# Altium schematic sheet PCB1.schdoc
size 306 x 217 mm; SheetNumber: 1; SheetTotal: 1
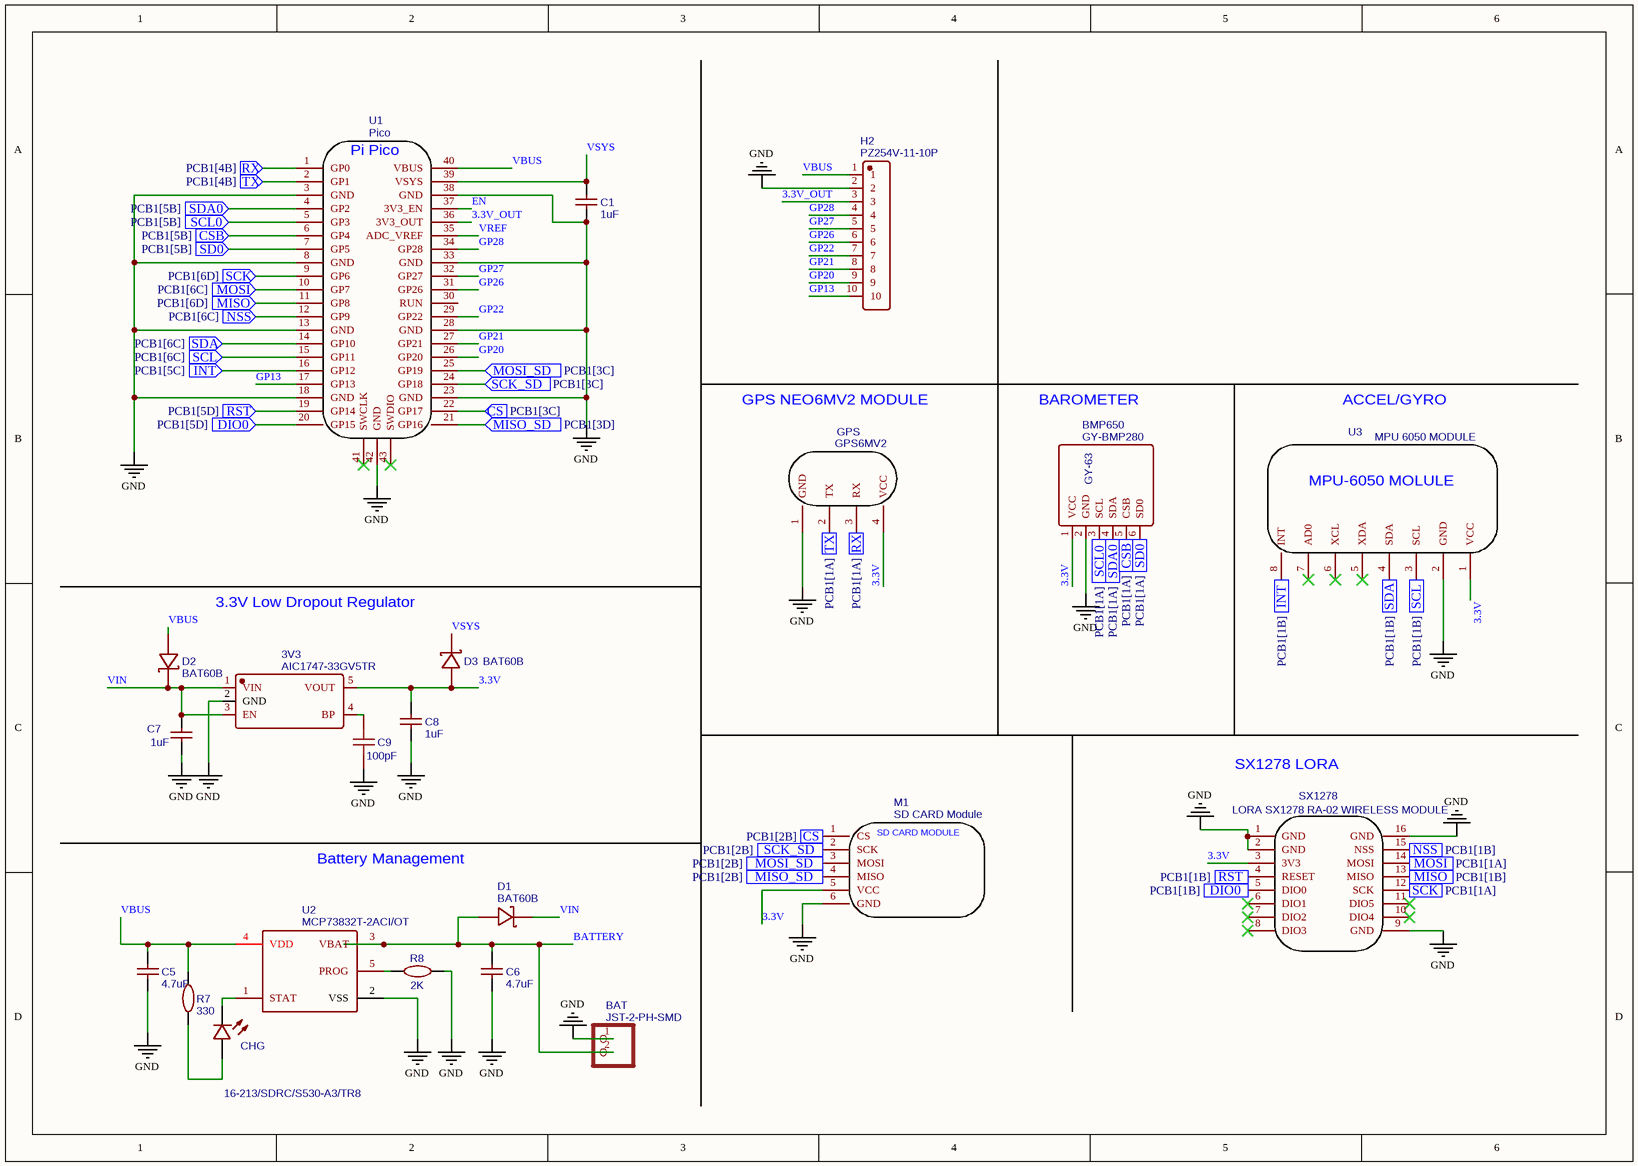
[diagram p0: PCB1.schdoc]

## Parts
3V3  AIC1747-33GV5TR  [SOT-23-5_L3.0-W1.7-P0.95-LS2.8-BL]
BAT  JST-2-PH-SMD  [JST-PH2-SMD]
BMP650  GY-BMP280  [GY-BMP280]
C1  1uF  [C0402]
C5  4.7uF  [C0805]
C6  4.7uF  [C0805]
C7  1uF  [C0603]
C8  1uF  [C0603]
C9  100pF  [C0603]
CHG  16-213/SDRC/S530-A3/TR8  [LED0402-RD]
D1  BAT60B  [SOD-323_L1.8-W1.3-LS2.5-RD]
D2  BAT60B  [SOD-323_L1.8-W1.3-LS2.5-RD]
D3  BAT60B  [SOD-323_L1.8-W1.3-LS2.5-RD]
GPS  GPS6MV2  [GPS-RECEIVER-NEO6MV2 UP SIDE DOWN]
H2  PZ254V-11-10P  [HDR-TH_10P-P2.54-V-M]
M1  SD CARD Module  [SD CARD MODULE]
R7  330  [R0402]
R8  2K  [R0402]
SX1278  LORA SX1278 RA-02 WIRELESS MODULE  [LORA SX1278 RA-02 WIRELESS MODULE]
U1  Pico  [RASPBERRY_PI_PICO_CASTELLATED]
U2  MCP73832T-2ACI/OT  [SOT-23-5_L3.0-W1.7-P0.95-LS2.8-BR]
U3  MPU 6050 MODULE  [MPU 6050 MODULE]

## Ports
CS (in, see PCB1[2B]), CS (in, see PCB1[3C]), CSB (in, see PCB1[1A]), CSB (in, see PCB1[5B]), DIO0 (in, see PCB1[1B]), DIO0 (in, see PCB1[5D]), INT (in, see PCB1[1B]), INT (in, see PCB1[5C]), MISO (in, see PCB1[1B]), MISO (in, see PCB1[6D]), MISO_SD (in, see PCB1[2B]), MISO_SD (in, see PCB1[3D]), MOSI (in, see PCB1[1A]), MOSI (in, see PCB1[6C]), MOSI_SD (in, see PCB1[2B]), MOSI_SD (in, see PCB1[3C]), NSS (in, see PCB1[1B]), NSS (in, see PCB1[6C]), RST (in, see PCB1[1B]), RST (in, see PCB1[5D]), RX (in, see PCB1[1A]), RX (in, see PCB1[4B]), SCK (in, see PCB1[1A]), SCK (in, see PCB1[6D]), SCK_SD (in, see PCB1[2B]), SCK_SD (in, see PCB1[3C]), SCL0 (in, see PCB1[1A]), SCL0 (in, see PCB1[5B]), SCL (in, see PCB1[1B]), SCL (in, see PCB1[6C]), SD0 (in, see PCB1[1A]), SD0 (in, see PCB1[5B]), SDA0 (in, see PCB1[1A]), SDA0 (in, see PCB1[5B]), SDA (in, see PCB1[1B]), SDA (in, see PCB1[6C]), TX (in, see PCB1[1A]), TX (in, see PCB1[4B])

## Nets
GND: 3V3.2(GND) BAT.1(-) BMP650.2(GND) C1.1 C5.1 C6.1 C7.1 C8.1 C9.1 GPS.1(GND) H2.2 M1.6(GND) R8.2 SX1278.1(GND) SX1278.2(GND) SX1278.9(GND) SX1278.16(GND) U1.3(GND) U1.8(GND) U1.13(GND) U1.18(GND) U1.23(GND) U1.28(GND) U1.33(GND) U1.38(GND) U1.42(GND) U2.2(VSS) U3.2(GND)
3.3V: 3V3.5(VOUT) BMP650.1(VCC) C8.2 D3.2(A) GPS.4(VCC) M1.5(VCC) SX1278.3(3V3) U3.1(VCC)
3.3V_OUT: H2.3 U1.36(3V3_OUT)
BATTERY: BAT.2(+) C6.2 D1.2(A) U2.3(VBAT)
CS: M1.1(CS) U1.22(GP17) ; port CS
CSB: BMP650.5(CSB) U1.6(GP4) ; port CSB
DIO0: SX1278.5(DIO0) U1.20(GP15) ; port DIO0
EN: U1.37(3V3_EN)
GP13: H2.10 U1.17(GP13)
GP20: H2.9 U1.26(GP20)
GP21: H2.8 U1.27(GP21)
GP22: H2.7 U1.29(GP22)
GP26: H2.6 U1.31(GP26)
GP27: H2.5 U1.32(GP27)
GP28: H2.4 U1.34(GP28)
INT: U1.16(GP12) U3.8(INT) ; port INT
MISO: SX1278.13(MISO) U1.11(GP8) ; port MISO
MISO_SD: M1.4(MISO) U1.21(GP16) ; port MISO_SD
MOSI: SX1278.14(MOSI) U1.10(GP7) ; port MOSI
MOSI_SD: M1.3(MOSI) U1.25(GP19) ; port MOSI_SD
NSS: SX1278.15(NSS) U1.12(GP9) ; port NSS
RST: SX1278.4(RESET) U1.19(GP14) ; port RST
RX: GPS.3(RX) U1.1(GP0) ; port RX
SCK: SX1278.12(SCK) U1.9(GP6) ; port SCK
SCK_SD: M1.2(SCK) U1.24(GP18) ; port SCK_SD
SCL: U1.15(GP11) U3.3(SCL) ; port SCL
SCL0: BMP650.3(SCL) U1.5(GP3) ; port SCL0
SD0: BMP650.6(SD0) U1.7(GP5) ; port SD0
SDA: U1.14(GP10) U3.4(SDA) ; port SDA
SDA0: BMP650.4(SDA) U1.4(GP2) ; port SDA0
TX: GPS.2(TX) U1.2(GP1) ; port TX
VBUS: C5.2 D2.2(A) H2.1 R7.1 U1.40(VBUS) U2.4(VDD)
VIN: 3V3.1(VIN) 3V3.3(EN) C7.2 D1.1(K) D2.1(K)
VREF: U1.35(ADC_VREF)
VSYS: C1.2 D3.1(K) U1.39(VSYS)
Net3V3_4: 3V3.4(BP) C9.2
NetCHG_1: CHG.1(-) U2.1(STAT)
NetCHG_2: CHG.2(+) R7.2
NetR8_1: R8.1 U2.5(PROG)

Not connected (* = marked no-connect by the designer): SX1278 6(DIO1)* 7(DIO2)* 8(DIO3)* 10(DIO4)* 11(DIO5)*; U1 30(RUN) 41(SWCLK)* 43(SWDIO)*; U3 5(XDA)* 6(XCL)* 7(AD0)*

## Notes on the sheet
- GPS NEO6MV2 MODULE
- BAROMETER
- ACCEL/GYRO
- 3.3V Low Dropout Regulator
- SX1278 LORA
- Battery Management
- (in symbol GY-BMP280) GY-63
- (in symbol MPU 6050 MODULE) MPU-6050 MOLULE
- (in symbol SD CARD Module) SD CARD MODULE

## Library data of the parts
3V3 = AIC1747-33GV5TR: Manufacturer: Analog Integrations; Contributor: LCSC; Supplier: LCSC; Supplier Part: C238242; Manufacturer Part: AIC1747-33GV5TR; JLCPCB Part Class: Extended Part; spicePre: U; spiceSymbolName: AIC1747-33GV5TR
BAT = JST-2-PH-SMD: Contributor: vosegaard; spicePre: U; spiceSymbolName: JST-2-PH-SMD
BMP650 = GY-BMP280: Contributor: umitmehmet2000; Manufacturer Part: GY-BMP280; spicePre: U; spiceSymbolName: GY-BMP280
C1 = 1uF: Manufacturer Part: CL05A105KP5NNNC; Manufacturer: SAMSUNG; nameAlias: Capacitance; Supplier: LCSC; Supplier Part: C14445; JLCPCB Part Class: Extended Part; spicePre: C; spiceSymbolName: CL05A105KP5NNNC
C5 C6 = 4.7uF: Manufacturer Part: CL21A475KAQNNNE; Manufacturer: SAMSUNG; nameAlias: Capacitance; Supplier: LCSC; Supplier Part: C1779; JLCPCB Part Class: Basic Part; spicePre: C; spiceSymbolName: CL21A475KAQNNNE
C7 C8 = 1uF: Manufacturer Part: CL10A105KP8NNNC; Manufacturer: SAMSUNG; nameAlias: Capacitance; Supplier: LCSC; Supplier Part: C26413; JLCPCB Part Class: Extended Part; spicePre: C; spiceSymbolName: CL10A105KP8NNNC
C9 = 100pF: Manufacturer: YAGEO; Manufacturer Part: CC0603JRNPO9BN101; nameAlias: Capacitance; Supplier: LCSC; Supplier Part: C14665; JLCPCB Part Class: Extended Part; spicePre: C; spiceSymbolName: CC0603JRNPO9BN101
CHG = 16-213/SDRC/S530-A3/TR8: Manufacturer: EVERLIGHT; Supplier: LCSC; Manufacturer Part: 16-213/SDRC/S530-A3/TR8; image: //image.lceda.cn/szlcsc/C71911.jpg; Supplier Part: C71911; JLCPCB Part Class: Extended Part; spicePre: L; spiceSymbolName: 16-213/SDRC/S530-A3/TR8
D1-D3 = BAT60B: Manufacturer: CJ; Supplier: LCSC; Manufacturer Part: BAT60B; image: //image.lceda.cn/szlcsc/C22638.jpg; Supplier Part: C22638; JLCPCB Part Class: Extended Part; spicePre: D; spiceSymbolName: BAT60B
GPS = GPS6MV2: Contributor: bacamezeu; spicePre: U; spiceSymbolName: GPS6MV2
H2 = PZ254V-11-10P: Manufacturer: XFCN; Contributor: LCSC; Supplier: LCSC; Supplier Part: C492409; Manufacturer Part: PZ254V-11-10P; JLCPCB Part Class: Extended Part; spicePre: H; spiceSymbolName: PZ254V-11-10P
M1 = SD CARD Module: Contributor: ashwin2abhang; spicePre: M; spiceSymbolName: SD CARD Module
R7 = 330: Manufacturer: UniOhm; Manufacturer Part: 0402WGJ0331TCE; nameAlias: Resistance (Ohms); Supplier: LCSC; Supplier Part: C12246; JLCPCB Part Class: Extended Part; spicePre: R; spiceSymbolName: 0402WGJ0331TCE
R8 = 2K: Manufacturer Part: 0402WGF2001TCE; Manufacturer: UniOhm; nameAlias: Resistance (Ohms); Supplier: LCSC; Supplier Part: C4109; JLCPCB Part Class: Basic Part; spicePre: R; spiceSymbolName: 0402WGF2001TCE
SX1278 = LORA SX1278 RA-02 WIRELESS MODULE: Contributor: rhalfcaacbay; spicePre: M; spiceSymbolName: LORA SX1278 RA-02 WIRELESS MODULE
U1 = Pico: Manufacturer: Raspberry Pi Foundation; Manufacturer Part: Pi Pico; Contributor: TomPilot; Supplier: Raspberry Pi; Supplier Part: Pi Pico; link: https://datasheets.raspberrypi.org/pico/pico_datasheet.pdf; spicePre: U; spiceSymbolName: Pico
U2 = MCP73832T-2ACI/OT: Manufacturer: MICROCHIP; Supplier: LCSC; Manufacturer Part: MCP73832T-2ACI/OT; image: //image.lceda.cn/szlcsc/C38066.jpg; Supplier Part: C38066; JLCPCB Part Class: Extended Part; spicePre: U; spiceSymbolName: MCP73832T-2ACI/OT
U3 = MPU 6050 MODULE: Contributor: Waleed Kies; spicePre: U; spiceSymbolName: MPU 6050 MODULE